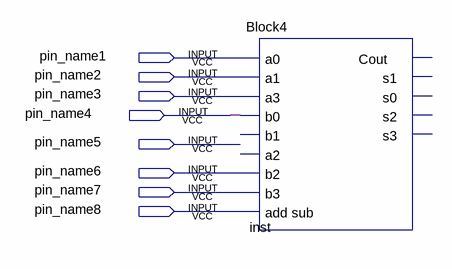
[diagram p0: schematic sheet]
// Quartus schematic Block5.bdf as structural Verilog: 1 symbols, 8 pins
module Block5 (
  input  pin_name1,
  input  pin_name2,
  input  pin_name3,
  input  pin_name4,
  input  pin_name5,
  input  pin_name6,
  input  pin_name7,
  input  pin_name8
);

  Block4 inst (
    .a0(pin_name1), .a1(pin_name2), .a3(pin_name3), .b0(pin_name4), .b2(pin_name6), .b3(pin_name7),
    .\add_sub (pin_name8));  // open: b1, a2, Cout, s1, s0, s2, s3
endmodule
